# EAGLE design microstepper (EAGLE 7.6.0)

## Sheet 1 of 3
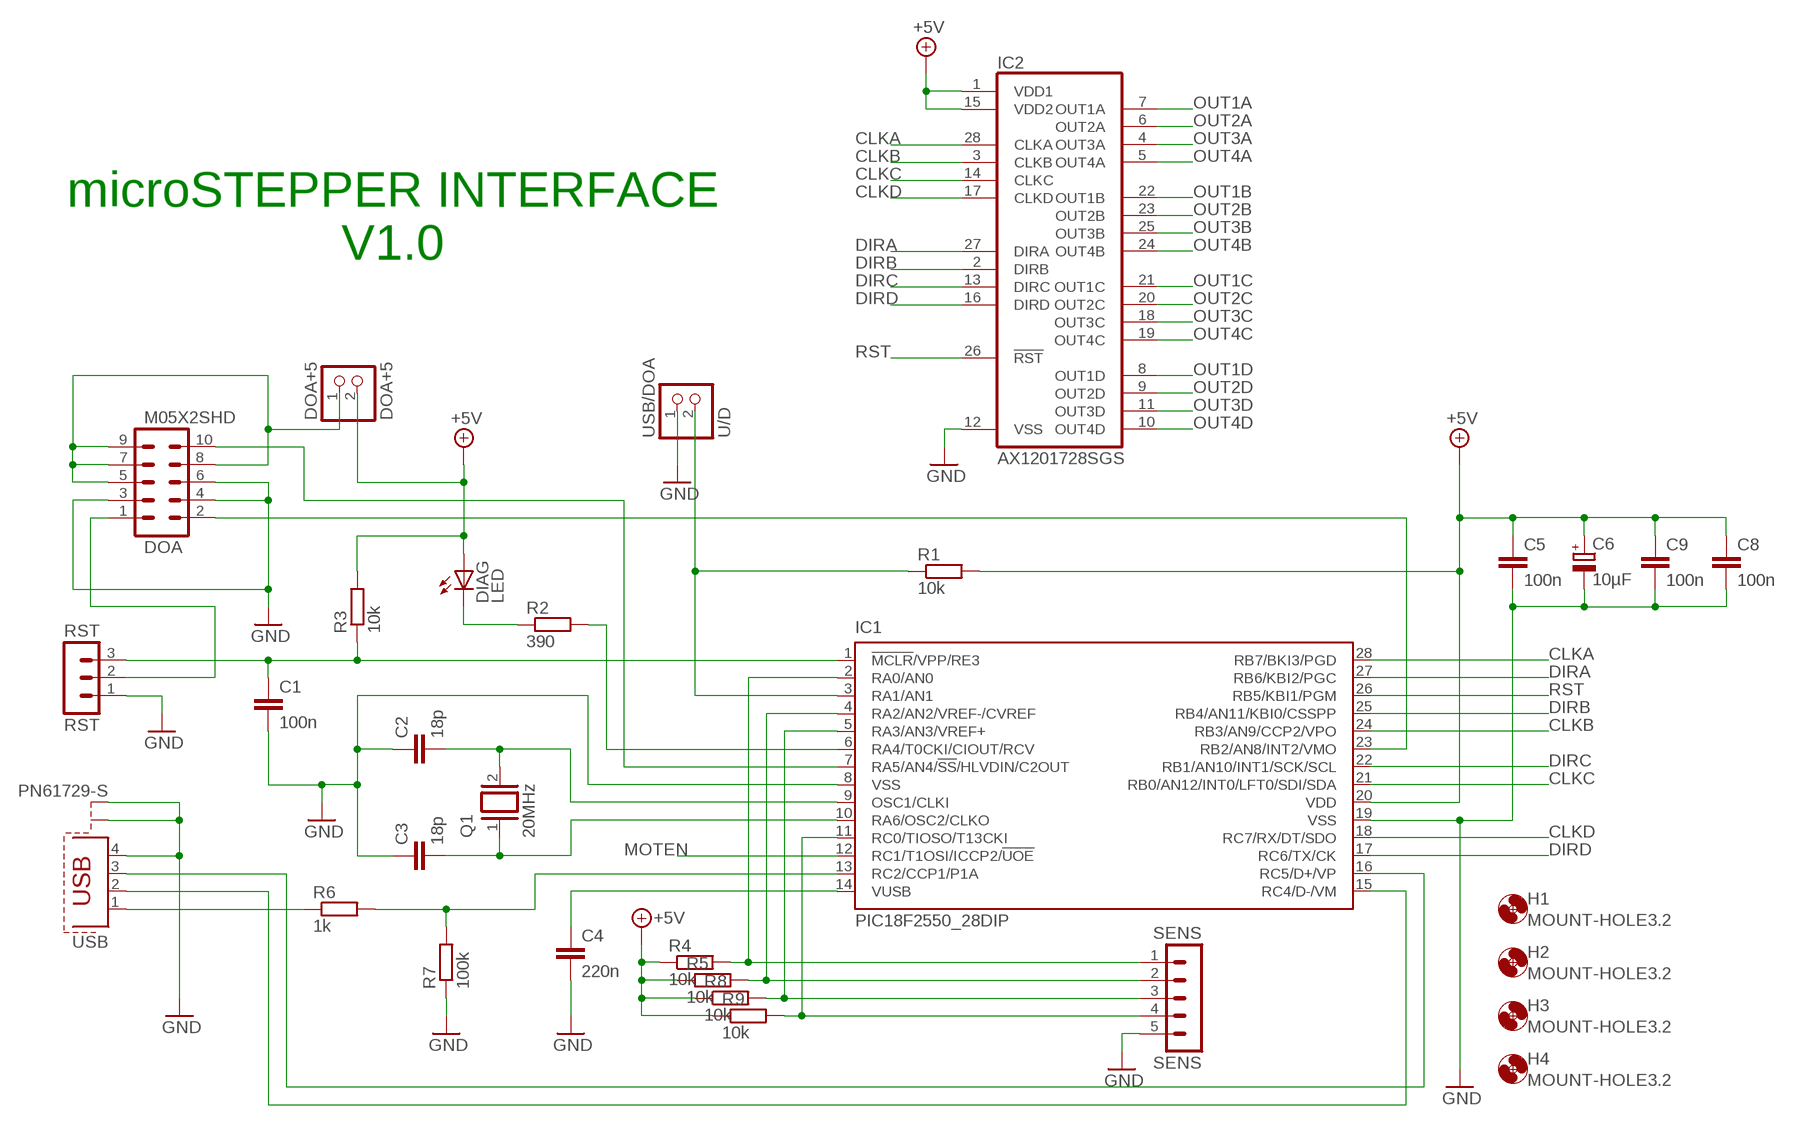
[diagram p0: schematic, sheet 1]

### Parts
C1  100n  C-EU025-025X050  [C025-025X050]
C2  18p  C-EU025-025X050  [C025-025X050]
C3  18p  C-EU025-025X050  [C025-025X050]
C4  220n  C5/3  [C5B3]
C5  100n  C-EU025-025X050  [C025-025X050]
C6  10µF  CPOL-EUE2.5-5  [E2,5-5]
C8  100n  C-EU025-025X050  [C025-025X050]
C9  100n  C-EU025-025X050  [C025-025X050]
DIAG  LED  LED3MM  [LED3MM]
DOA  M05X2SHD  [2X5-SHROUDED]
DOA+5  DOA+5  PINHD-1X2  [1X02]
H1  MOUNT-HOLE3.2  [3,2]
H2  MOUNT-HOLE3.2  [3,2]
H3  MOUNT-HOLE3.2  [3,2]
H4  MOUNT-HOLE3.2  [3,2]
IC1  PIC18F2550_28DIP  [DIL28-3]
IC2  AX1201728SGS  [SOP-28]
Q1  20MHz  XTAL/S  [QS]
R1  10k  R-EU_0204/7  [0204/7]
R2  390  R-EU_0204/7  [0204/7]
R3  10k  R-EU_0204/7  [0204/7]
R4  10k  R-EU_0204/7  [0204/7]
R5  10k  R-EU_0204/7  [0204/7]
R6  1k  R-EU_0204/7  [0204/7]
R7  100k  R-EU_0204/7  [0204/7]
R8  10k  R-EU_0204/7  [0204/7]
R9  10k  R-EU_0204/7  [0204/7]
RST  RST  MA03-1  [MA03-1]
SENS  SENS  MA05-1  [MA05-1]
USB  PN61729-S  [PN61729-S]
USB/DOA  U/D  PINHD-1X2  [1X02]

### Nets
+5V [+5V]: C5.1 C6.+ C8.1 C9.1 DIAG.A DOA+5.2 IC1.20(VDD) IC2.1(VDD1) IC2.15(VDD2) R1.2 R3.2 R4.1 R5.1 R8.1 R9.1 ; also sheet 2,3
CLKA: IC1.28(RB7/BKI3/PGD) IC2.28(CLKA)
CLKB: IC1.24(RB3/AN9/CCP2/VPO) IC2.3(CLKB)
CLKC: IC1.21(RB0/AN12/INT0/LFT0/SDI/SDA) IC2.14(CLKC)
CLKD: IC1.18(RC7/RX/DT/SDO) IC2.17(CLKD)
DIRA: IC1.27(RB6/KBI2/PGC) IC2.27(DIRA)
DIRB: IC1.25(RB4/AN11/KBI0/CSSPP) IC2.2(DIRB)
DIRC: IC1.22(RB1/AN10/INT1/SCK/SCL) IC2.13(DIRC)
DIRD: IC1.17(RC6/TX/CK) IC2.16(DIRD)
GND [ground]: C1.2 C2.1 C3.1 C4.2 C5.2 C6.- C8.2 C9.2 DOA.3 DOA.4 DOA.6 IC1.8(VSS) IC1.19(VSS) IC2.12(VSS) R7.1 RST.1 SENS.5 USB.4 USB.S1 USB.S2 USB/DOA.1 ; also sheet 2,3
MOTEN: IC1.12(RC1/T1OSI/ICCP2/!UOE) ; also sheet 2
N$9: IC1.11(RC0/TIOSO/T13CKI) R9.2 SENS.4
N$12: IC1.5(RA3/AN3/VREF+) R8.2 SENS.3
N$13: IC1.4(RA2/AN2/VREF-/CVREF) R5.2 SENS.2
N$22: IC1.2(RA0/AN0) R4.2 SENS.1
N$51: C4.1 IC1.14(VUSB)
N$54: IC1.16(RC5/D+/VP) USB.3
N$61: IC1.15(RC4/D-/VM) USB.2
N$62: R6.1 USB.1
N$63: IC1.13(RC2/CCP1/P1A) R6.2 R7.2
N$64: DOA.1 RST.2
N$65: C3.2 IC1.10(RA6/OSC2/CLKO) Q1.1
N$66: C2.2 IC1.9(OSC1/CLKI) Q1.2
N$67: C1.1 IC1.1(!MCLR!/VPP/RE3) R3.1 RST.3
N$71 [+5V]: DOA+5.1 DOA.5 DOA.7 DOA.8 DOA.9
N$72: DOA.2 IC1.23(RB2/AN8/INT2/VMO)
N$73: DIAG.K(C) R2.1
N$74: IC1.6(RA4/T0CKI/CIOUT/RCV) R2.2
N$75: DOA.10 IC1.7(RA5/AN4/!SS!/HLVDIN/C2OUT)
N$76: IC1.3(RA1/AN1) R1.1 USB/DOA.2
OUT1A: IC2.7(OUT1A) ; also sheet 2,3
OUT1B: IC2.22(OUT1B) ; also sheet 2,3
OUT1C: IC2.21(OUT1C) ; also sheet 2,3
OUT1D: IC2.8(OUT1D) ; also sheet 2,3
OUT2A: IC2.6(OUT2A) ; also sheet 2,3
OUT2B: IC2.23(OUT2B) ; also sheet 2,3
OUT2C: IC2.20(OUT2C) ; also sheet 2,3
OUT2D: IC2.9(OUT2D) ; also sheet 2,3
OUT3A: IC2.4(OUT3A) ; also sheet 2,3
OUT3B: IC2.25(OUT3B) ; also sheet 2,3
OUT3C: IC2.18(OUT3C) ; also sheet 2,3
OUT3D: IC2.11(OUT3D) ; also sheet 2,3
OUT4A: IC2.5(OUT4A) ; also sheet 2,3
OUT4B: IC2.24(OUT4B) ; also sheet 2,3
OUT4C: IC2.19(OUT4C) ; also sheet 2,3
OUT4D: IC2.10(OUT4D) ; also sheet 2,3
RST: IC1.26(RB5/KBI1/PGM) IC2.26(!RST)

### Notes on the sheet
- microSTEPPER INTERFACE
  V1.0

## Sheet 2 of 3
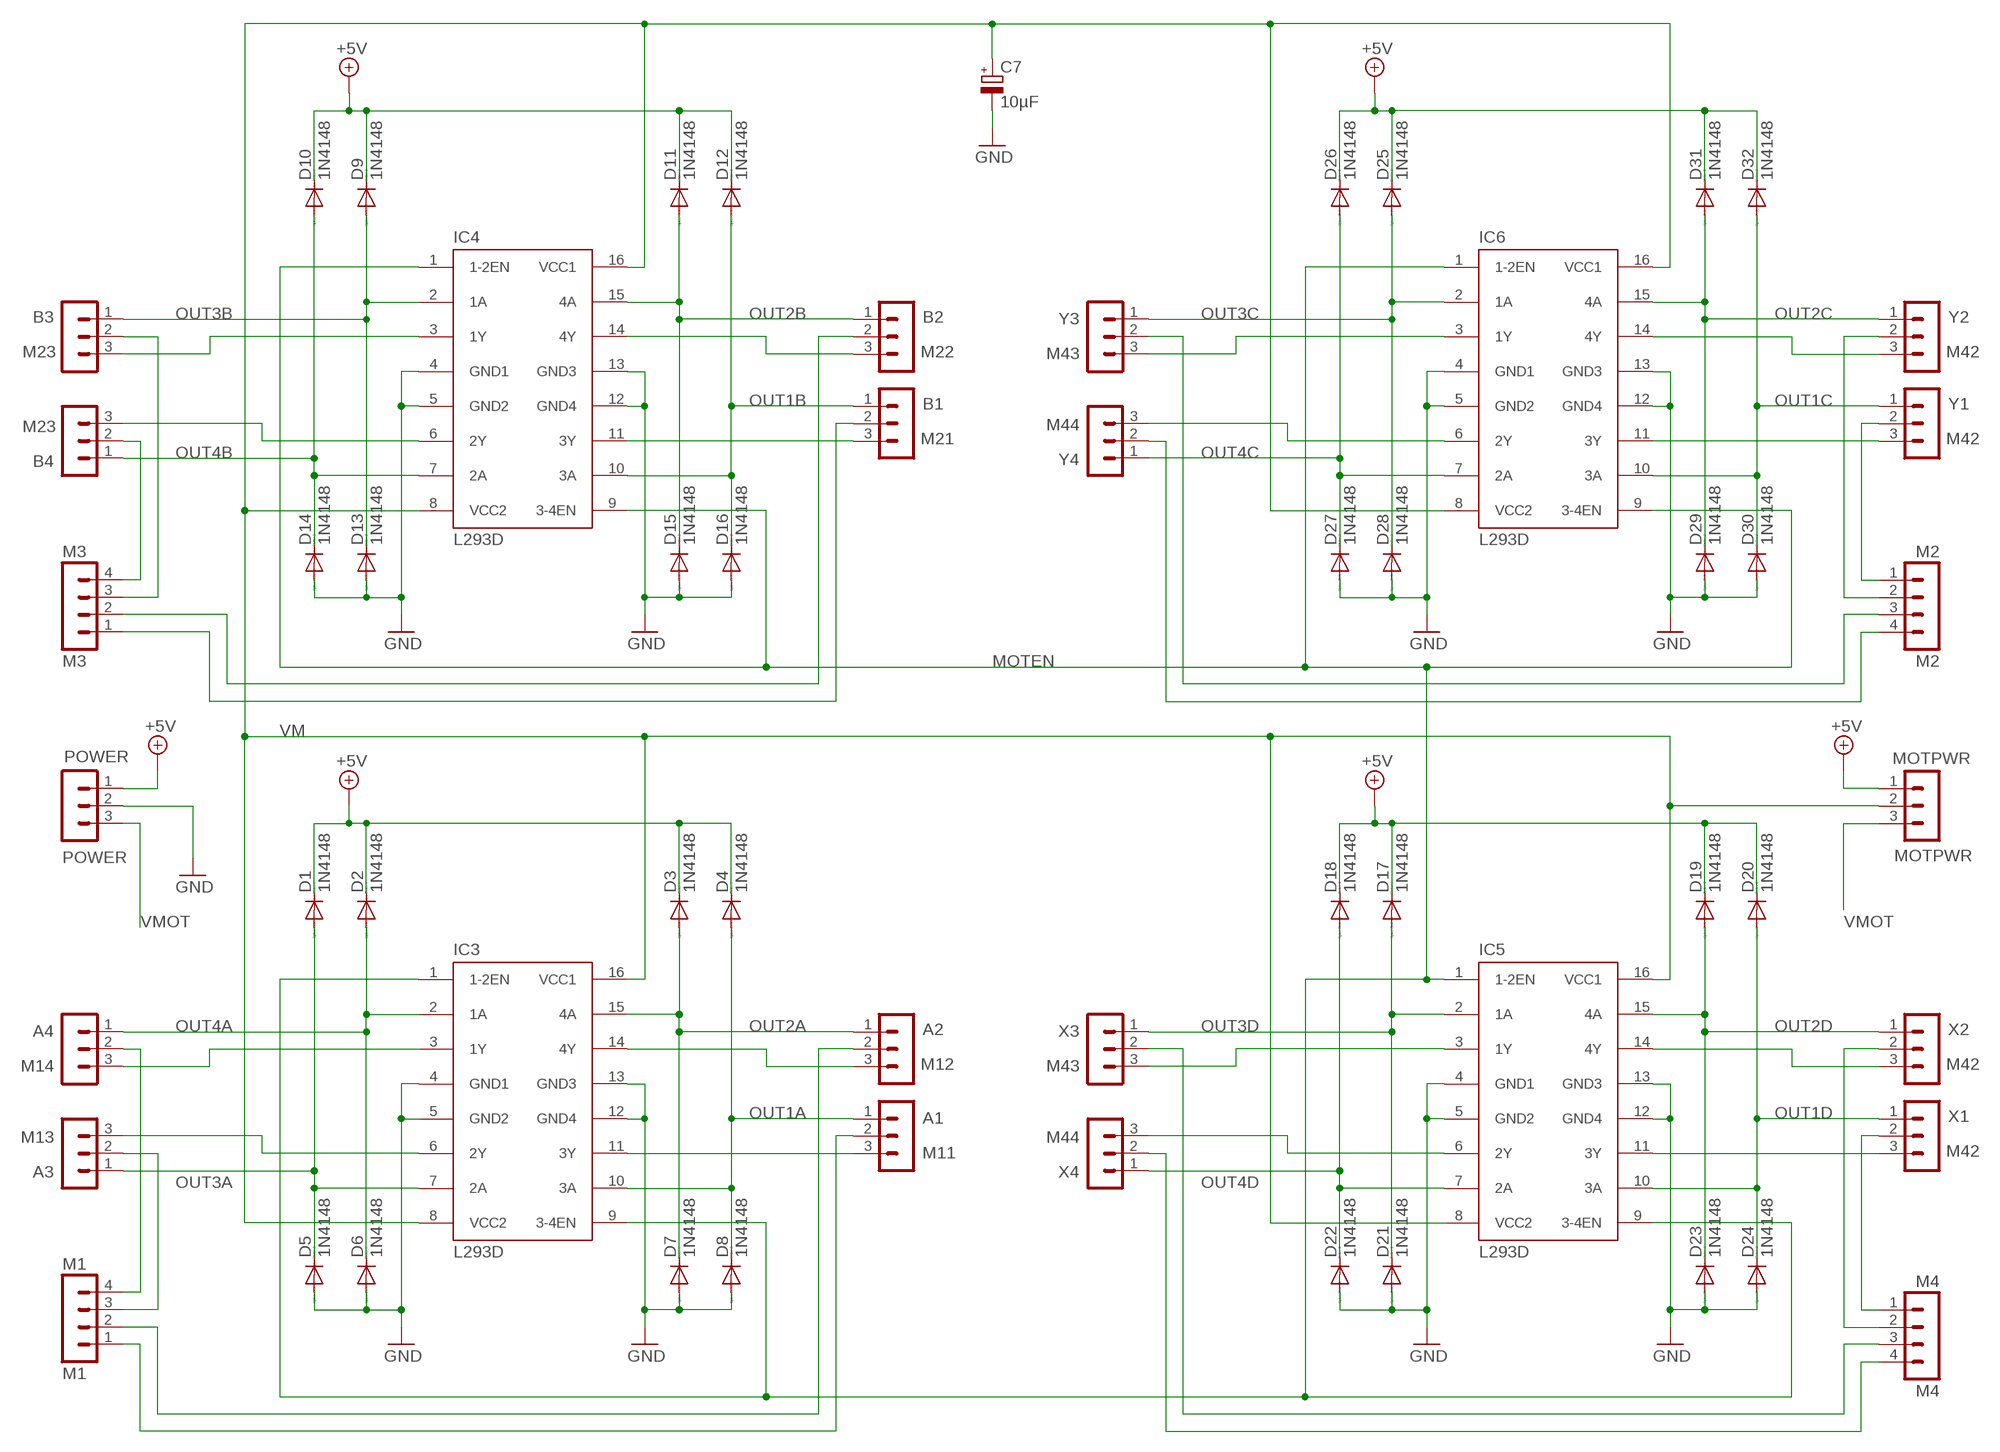
[diagram p1: schematic, sheet 2]

### Parts
A1  M11  MA03-1  [MA03-1]
A2  M12  MA03-1  [MA03-1]
A3  M13  MA03-1  [MA03-1]
A4  M14  MA03-1  [MA03-1]
B1  M21  MA03-1  [MA03-1]
B2  M22  MA03-1  [MA03-1]
B3  M23  MA03-1  [MA03-1]
B4  M23  MA03-1  [MA03-1]
C7  10µF  CPOL-EUE2.5-5  [E2,5-5]
D1  1N4148  1N4148DO35-7  [DO35-7]
D2  1N4148  1N4148DO35-7  [DO35-7]
D3  1N4148  1N4148DO35-7  [DO35-7]
D4  1N4148  1N4148DO35-7  [DO35-7]
D5  1N4148  1N4148DO35-7  [DO35-7]
D6  1N4148  1N4148DO35-7  [DO35-7]
D7  1N4148  1N4148DO35-7  [DO35-7]
D8  1N4148  1N4148DO35-7  [DO35-7]
D9  1N4148  1N4148DO35-7  [DO35-7]
D10  1N4148  1N4148DO35-7  [DO35-7]
D11  1N4148  1N4148DO35-7  [DO35-7]
D12  1N4148  1N4148DO35-7  [DO35-7]
D13  1N4148  1N4148DO35-7  [DO35-7]
D14  1N4148  1N4148DO35-7  [DO35-7]
D15  1N4148  1N4148DO35-7  [DO35-7]
D16  1N4148  1N4148DO35-7  [DO35-7]
D17  1N4148  1N4148DO35-7  [DO35-7]
D18  1N4148  1N4148DO35-7  [DO35-7]
D19  1N4148  1N4148DO35-7  [DO35-7]
D20  1N4148  1N4148DO35-7  [DO35-7]
D21  1N4148  1N4148DO35-7  [DO35-7]
D22  1N4148  1N4148DO35-7  [DO35-7]
D23  1N4148  1N4148DO35-7  [DO35-7]
D24  1N4148  1N4148DO35-7  [DO35-7]
D25  1N4148  1N4148DO35-7  [DO35-7]
D26  1N4148  1N4148DO35-7  [DO35-7]
D27  1N4148  1N4148DO35-7  [DO35-7]
D28  1N4148  1N4148DO35-7  [DO35-7]
D29  1N4148  1N4148DO35-7  [DO35-7]
D30  1N4148  1N4148DO35-7  [DO35-7]
D31  1N4148  1N4148DO35-7  [DO35-7]
D32  1N4148  1N4148DO35-7  [DO35-7]
IC3  L293D  [DIL16]
IC4  L293D  [DIL16]
IC5  L293D  [DIL16]
IC6  L293D  [DIL16]
M1  M1  MA04-1  [MA04-1]
M2  M2  MA04-1  [MA04-1]
M3  M3  MA04-1  [MA04-1]
M4  M4  MA04-1  [MA04-1]
MOTPWR  MOTPWR  MA03-1  [MA03-1]
POWER  POWER  MA03-1  [MA03-1]
X1  M42  MA03-1  [MA03-1]
X2  M42  MA03-1  [MA03-1]
X3  M43  MA03-1  [MA03-1]
X4  M44  MA03-1  [MA03-1]
Y1  M42  MA03-1  [MA03-1]
Y2  M42  MA03-1  [MA03-1]
Y3  M43  MA03-1  [MA03-1]
Y4  M44  MA03-1  [MA03-1]

### Nets
+5V [+5V]: D1.C D2.C D3.C D4.C D9.C D10.C D11.C D12.C D17.C D18.C D19.C D20.C D25.C D26.C D31.C D32.C MOTPWR.1 POWER.1 ; also sheet 1,3
GND [ground]: C7.- D5.A D6.A D7.A D8.A D13.A D14.A D15.A D16.A D21.A D22.A D23.A D24.A D27.A D28.A D29.A D30.A IC3.4(GND1) IC3.5(GND2) IC3.12(GND4) IC3.13(GND3) IC4.4(GND1) IC4.5(GND2) IC4.12(GND4) IC4.13(GND3) IC5.4(GND1) IC5.5(GND2) IC5.12(GND4) IC5.13(GND3) IC6.4(GND1) IC6.5(GND2) IC6.12(GND4) IC6.13(GND3) POWER.2 ; also sheet 1,3
MOTEN: IC3.1(1-2EN) IC3.9(3-4EN) IC4.1(1-2EN) IC4.9(3-4EN) IC5.1(1-2EN) IC5.9(3-4EN) IC6.1(1-2EN) IC6.9(3-4EN) ; also sheet 1
N$1: A1.3 IC3.11(3Y)
N$2: A2.3 IC3.14(4Y)
N$3: A3.3 IC3.6(2Y)
N$4: A4.3 IC3.3(1Y)
N$5: B2.3 IC4.14(4Y)
N$6: B1.3 IC4.11(3Y)
N$7: B4.3 IC4.6(2Y)
N$8: B3.3 IC4.3(1Y)
N$10: IC5.14(4Y) X2.3
N$11: IC5.11(3Y) X1.3
N$14: IC6.14(4Y) Y2.3
N$15: IC5.6(2Y) X4.3
N$16: IC6.11(3Y) Y1.3
N$17: IC5.3(1Y) X3.3
N$18: IC6.3(1Y) Y3.3
N$19: IC6.6(2Y) Y4.3
N$20: B1.2 M3.1
N$21: B2.2 M3.2
N$24: B4.2 M3.4
N$25: B3.2 M3.3
N$35: A4.2 M1.4
N$40: A3.2 M1.3
N$41: A1.2 M1.1
N$42: A2.2 M1.2
N$43: M4.1 X1.2
N$44: M4.2 X2.2
N$45: M4.4 X4.2
N$46: M4.3 X3.2
N$47: M2.1 Y1.2
N$48: M2.2 Y2.2
N$49: M2.4 Y4.2
N$50: M2.3 Y3.2
OUT1A: A1.1 D4.A D8.C IC3.10(3A) ; also sheet 1,3
OUT1B: B1.1 D12.A D16.C IC4.10(3A) ; also sheet 1,3
OUT1C: D30.C D32.A IC6.10(3A) Y1.1 ; also sheet 1,3
OUT1D: D20.A D24.C IC5.10(3A) X1.1 ; also sheet 1,3
OUT2A: A2.1 D3.A D7.C IC3.15(4A) ; also sheet 1,3
OUT2B: B2.1 D11.A D15.C IC4.15(4A) ; also sheet 1,3
OUT2C: D29.C D31.A IC6.15(4A) Y2.1 ; also sheet 1,3
OUT2D: D19.A D23.C IC5.15(4A) X2.1 ; also sheet 1,3
OUT3A: A3.1 D1.A D5.C IC3.7(2A) ; also sheet 1,3
OUT3B: B3.1 D9.A D13.C IC4.2(1A) ; also sheet 1,3
OUT3C: D25.A D28.C IC6.2(1A) Y3.1 ; also sheet 1,3
OUT3D: D17.A D21.C IC5.2(1A) X3.1 ; also sheet 1,3
OUT4A: A4.1 D2.A D6.C IC3.2(1A) ; also sheet 1,3
OUT4B: B4.1 D10.A D14.C IC4.7(2A) ; also sheet 1,3
OUT4C: D26.A D27.C IC6.7(2A) Y4.1 ; also sheet 1,3
OUT4D: D18.A D22.C IC5.7(2A) X4.1 ; also sheet 1,3
VM [VM]: C7.+ IC3.8(VCC2) IC3.16(VCC1) IC4.8(VCC2) IC4.16(VCC1) IC5.8(VCC2) IC5.16(VCC1) IC6.8(VCC2) IC6.16(VCC1) MOTPWR.2
VMOT [VMOT]: MOTPWR.3 POWER.3

## Sheet 3 of 3
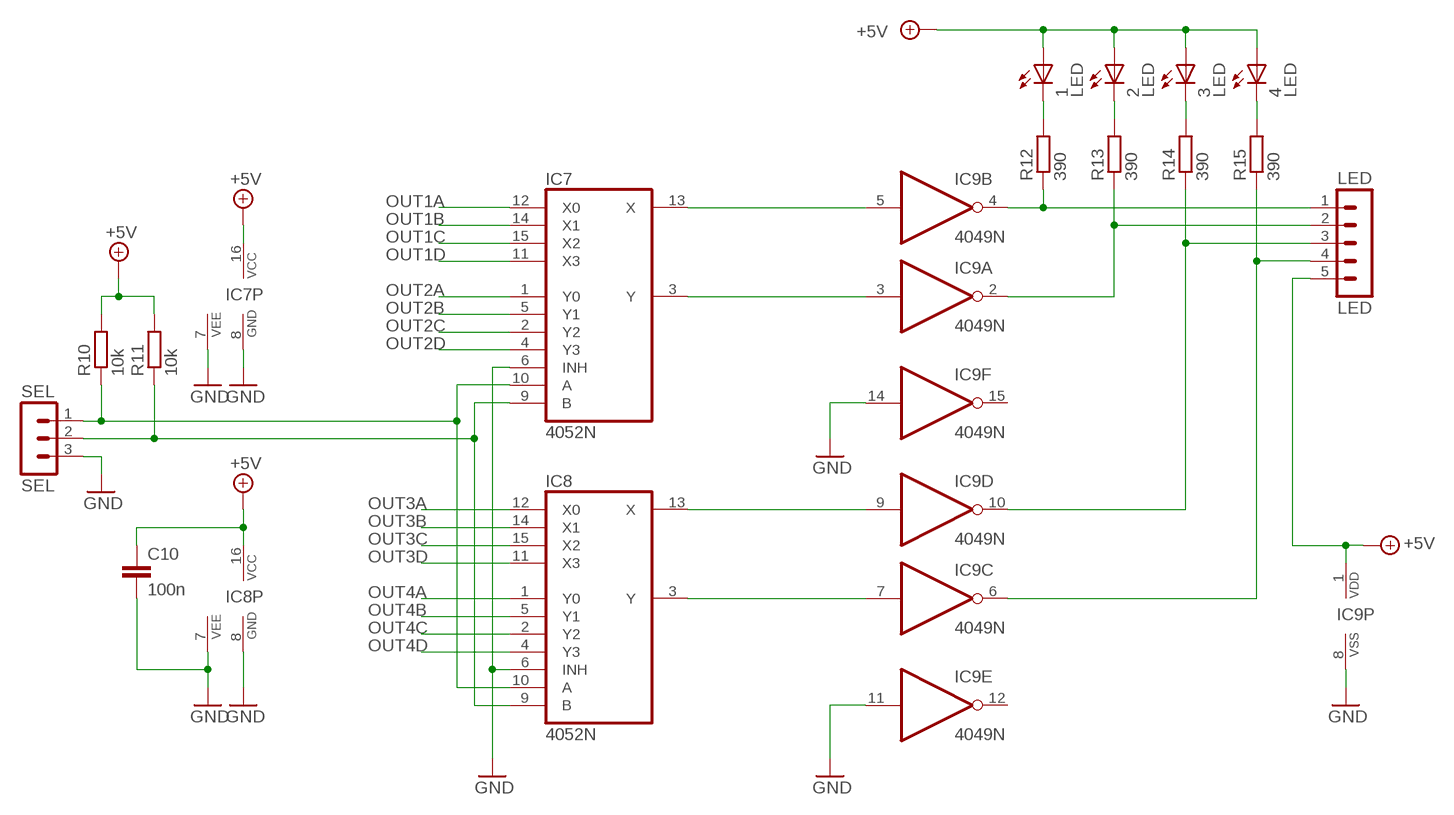
[diagram p2: schematic, sheet 3]

### Parts
1  LED  LED3MM  [LED3MM]
2  LED  LED3MM  [LED3MM]
3  LED  LED3MM  [LED3MM]
4  LED  LED3MM  [LED3MM]
C10  100n  C-EU025-025X050  [C025-025X050]
IC7  4052N  [DIL16]
IC8  4052N  [DIL16]
IC9  4049N  [DIL16]
LED  LED  MA05-1  [MA05-1]
R10  10k  R-EU_0204/7  [0204/7]
R11  10k  R-EU_0204/7  [0204/7]
R12  390  R-EU_0204/7  [0204/7]
R13  390  R-EU_0204/7  [0204/7]
R14  390  R-EU_0204/7  [0204/7]
R15  390  R-EU_0204/7  [0204/7]
SEL  SEL  MA03-1  [MA03-1]

### Nets
+5V [+5V]: 1.A 2.A 3.A 4.A C10.1 IC7.16(VCC) IC8.16(VCC) IC9.1(P:VDD) LED.5 R10.2 R11.2 ; also sheet 1,2
GND [ground]: C10.2 IC7.6(INH) IC7.7(VEE) IC7.8(GND) IC8.6(INH) IC8.7(VEE) IC8.8(GND) IC9.8(P:VSS) IC9.11(E:I) IC9.14(F:I) SEL.3 ; also sheet 1,2
N$23: IC7.9(B) IC8.9(B) R11.1 SEL.2
N$26: IC7.10(A) IC8.10(A) R10.1 SEL.1
N$27: IC7.3(Y) IC9.3(A:I)
N$28: IC7.13(X) IC9.5(B:I)
N$29: IC8.3(Y) IC9.7(C:I)
N$30: IC8.13(X) IC9.9(D:I)
N$31: IC9.4(B:O) LED.1 R12.1
N$32: IC9.2(A:O) LED.2 R13.1
N$33: IC9.10(D:O) LED.3 R14.1
N$34: IC9.6(C:O) LED.4 R15.1
N$36: 1.K(C) R12.2
N$37: 2.K(C) R13.2
N$38: 3.K(C) R14.2
N$39: 4.K(C) R15.2
OUT1A: IC7.12(X0) ; also sheet 1,2
OUT1B: IC7.14(X1) ; also sheet 1,2
OUT1C: IC7.15(X2) ; also sheet 1,2
OUT1D: IC7.11(X3) ; also sheet 1,2
OUT2A: IC7.1(Y0) ; also sheet 1,2
OUT2B: IC7.5(Y1) ; also sheet 1,2
OUT2C: IC7.2(Y2) ; also sheet 1,2
OUT2D: IC7.4(Y3) ; also sheet 1,2
OUT3A: IC8.12(X0) ; also sheet 1,2
OUT3B: IC8.14(X1) ; also sheet 1,2
OUT3C: IC8.15(X2) ; also sheet 1,2
OUT3D: IC8.11(X3) ; also sheet 1,2
OUT4A: IC8.1(Y0) ; also sheet 1,2
OUT4B: IC8.5(Y1) ; also sheet 1,2
OUT4C: IC8.2(Y2) ; also sheet 1,2
OUT4D: IC8.4(Y3) ; also sheet 1,2
Unconnected: IC9.12(E:O) IC9.15(F:O)

## Library data of the parts
1-4 DIAG = henk:LED: LEDs Standard schematic elements and footprints for 5mm, 3mm, 1206, and 0603 sized LEDs. 5mm - Spark Fun Electronics SKU : COM-00529 (and others)
A1-A4 B1-B4 MOTPWR POWER RST SEL X1-X4 Y1-Y4 = con-lstb:MA03-1: PIN HEADER; OC_FARNELL: unknown; OC_NEWARK: unknown
C1-C3 C5 C8-C10 = rcl:C-EU: CAPACITOR, European symbol
C4 = capacitor-wima:C: CAPACITOR naming: grid - package width
C6 C7 = rcl:CPOL-EU: POLARIZED CAPACITOR, European symbol
D1-D32 = diode:1N4148: DIODE high speed (Philips)
DOA = henk:M05X2: Header 5x2 Standard 10-pin dual row 0.1" header. Commonly used with AVR-ISP. Use with Spark Fun Electronics SKU: PRT-00778
DOA+5 USB/DOA = pinhead:PINHD-1X2: PIN HEADER
H1-H4 = holes:MOUNT-HOLE: MOUNTING HOLE with drill center marker
IC1 = microchip:PIC18F2*_28: USB Microcontrollers with nanoWatt Technology High-Performance, Enhanced Flash, 28/40/44-Pin, Source: http://ww1.microchip.com/downloads/en/devicedoc/39632c.pdf; MF: MICROCHIP; MPN: PIC18F2550-I/SP; OC_FARNELL: 1523822; OC_NEWARK: 80K6054
IC2 = memory-bsi:AX1201728SG
IC3-IC6 = st-microelectronics:L293D: PUSH-PULL 4 CHANNEL DRIVER; MPN: L293D; OC_FARNELL: 9589619; OC_NEWARK: 56P8249
IC7 IC8 = 40xx:4052: Dual 4-channel ANALOG MULTIPLEXER
IC9 = 40xx:4049: Hex inverting BUFFER
LED SENS = con-lstb:MA05-1: PIN HEADER; OC_FARNELL: unknown; OC_NEWARK: unknown
M1-M4 = con-lstb:MA04-1: PIN HEADER; OC_FARNELL: unknown; OC_NEWARK: unknown
Q1 = special:XTAL/S: CRYSTAL
R1-R15 = rcl:R-EU_: RESISTOR, European symbol
USB = con-berg:PN61729-S: BERG USB connector; OC_FARNELL: unknown; OC_NEWARK: unknown

## Net classes
0 default: width 0.254 mm, clearance 0.381 mm
1 ground: width 0.508 mm, clearance 0.381 mm
2 +5V: width 0.508 mm, clearance 0.381 mm
3 VMOT: width 0.508 mm, clearance 0.381 mm
4 VM: width 0.508 mm, clearance 0.381 mm

## Board
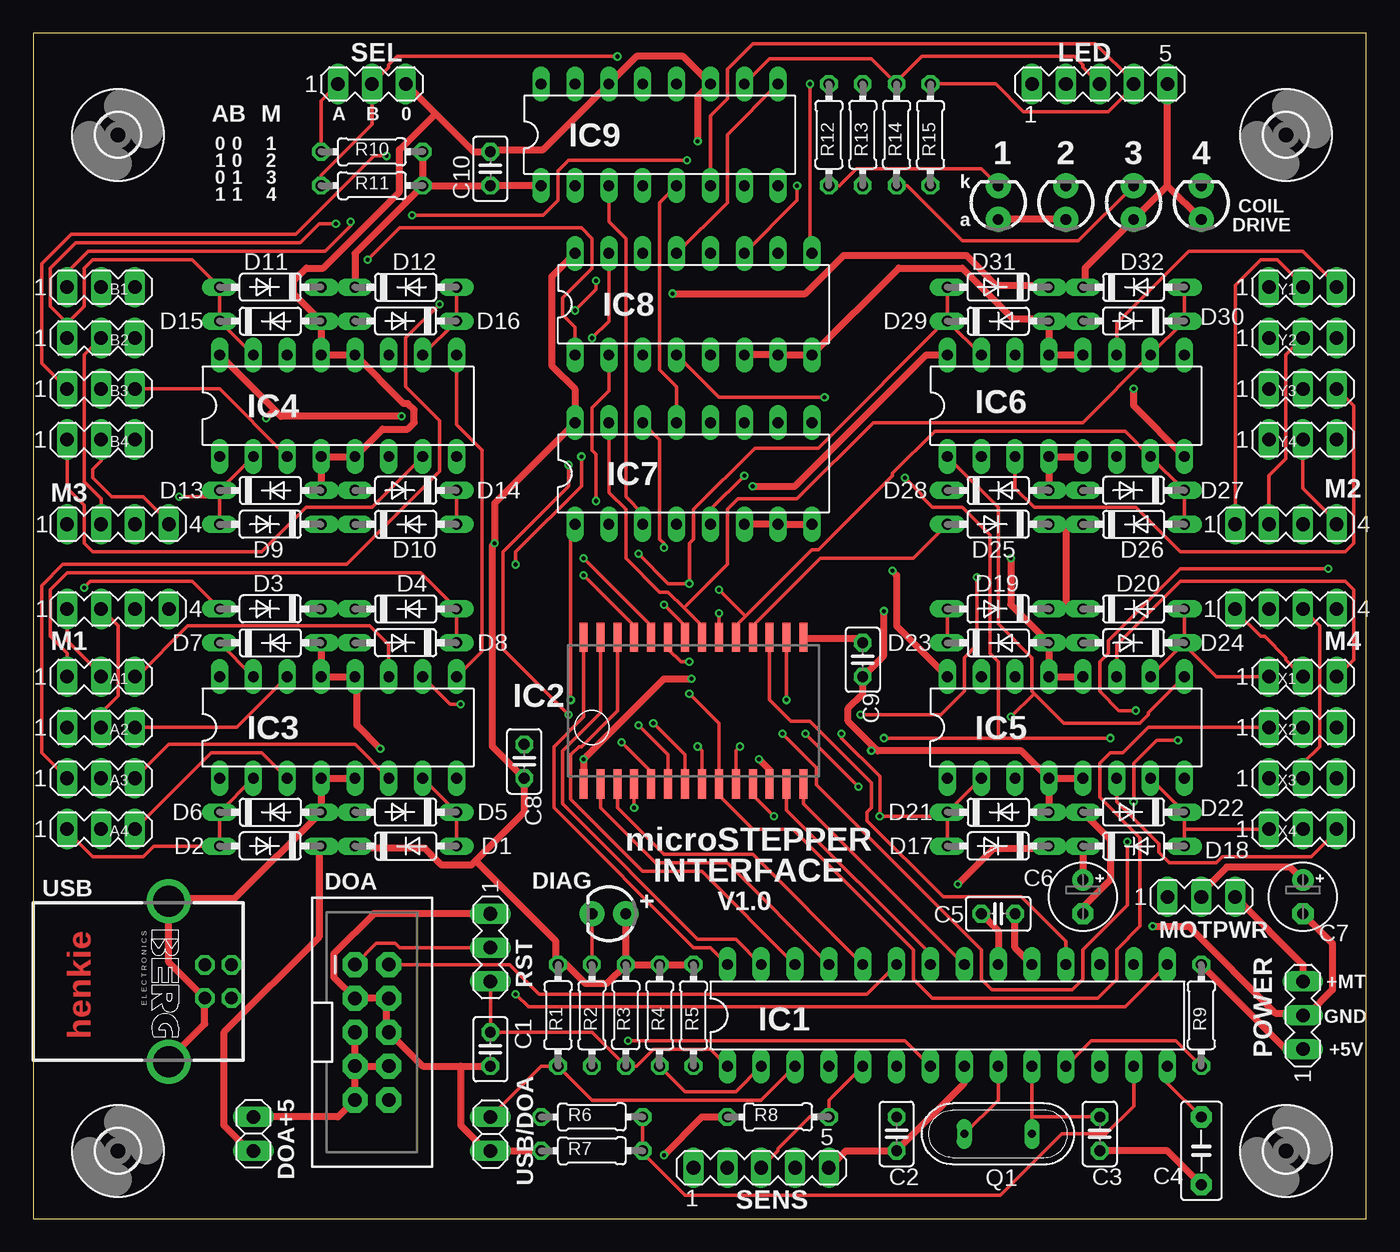
[diagram p3: board, top side]
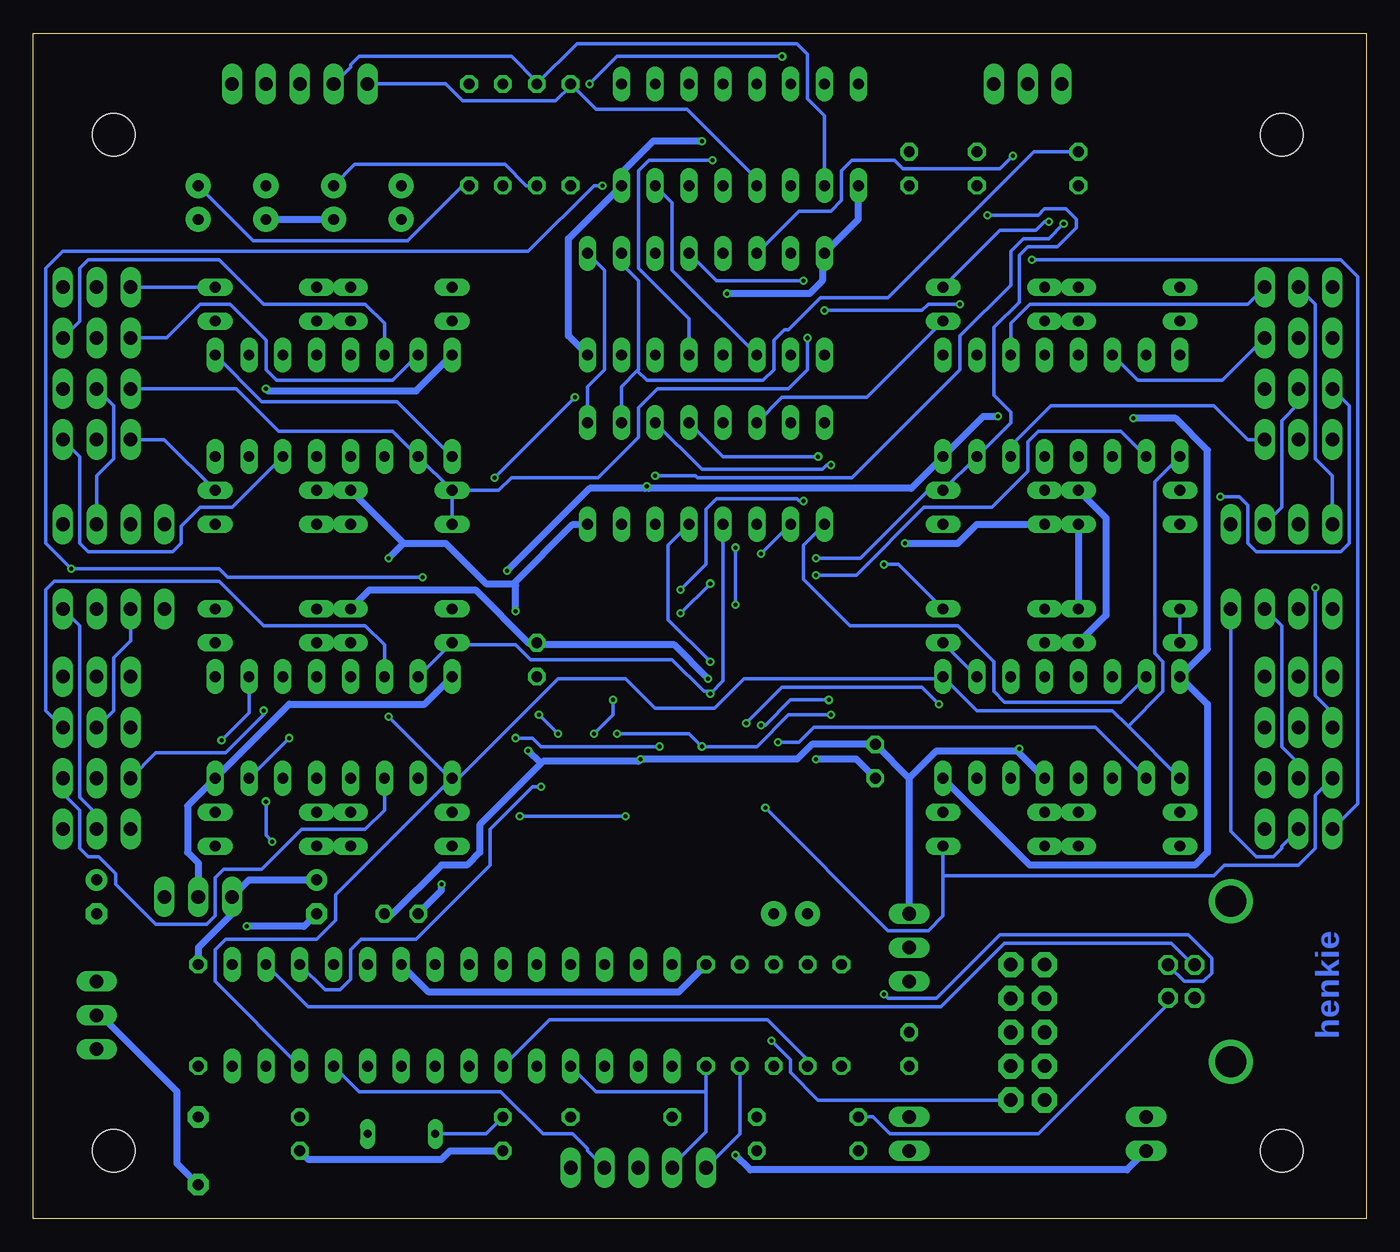
[diagram p4: board, bottom side, seen from below]

Size 100 x 88.89 mm. Coordinates in mm from the lower left corner, seen from the top.
Outline: 0,0 100,0 100,88.89 0,88.89 0,0
Copper layers (1*16): Top 0.035mm / dielectric 1.5mm / Bottom 0.035mm
Design rules "ITEADstudio_DRC": minimum track width 6mil, minimum drill 12mil, track to track 6mil, track to pad 6mil, pad to pad 6mil, via to via 6mil, smd to smd 0mil, copper to edge 10mil, drill to drill 10mil, minimum pad ring 10mil, minimum via ring 6mil, stop-mask expansion 2mil, vias tented up to drill 100mil, thermal gap 10mil

### Footprints (pad centres in the part's own frame; a part is rotated, then mirrored left to right if it is on the bottom)
LED3MM = drill 0.813 pad 1.88: A -1.27,0; K 1.27,0
MA03-1 = drill 1.016 long: 1 -2.54,0; 2 0,0; 3 2.54,0
C025-025X050 = drill 0.813 octagon: 1 -1.27,0; 2 1.27,0
C5B3 = drill 0.813 pad 1.6 octagon: 1 -2.54,0; 2 2.54,0
E2,5-5 = drill 0.813 pad 1.6: + -1.27,0 | drill 0.813 pad 1.6 octagon: - 1.27,0
DO35-7 = drill 0.813 long: A 3.81,0; C -3.81,0
2X5-SHROUDED = drill 1.016 pad 1.88 octagon: 1 -1.27,5.08; 2 1.27,5.08; 3 -1.27,2.54; 4 1.27,2.54; 5 -1.27,0; 6 1.27,0; 7 -1.27,-2.54; 8 1.27,-2.54; 9 -1.27,-5.08; 10 1.27,-5.08
1X02 = drill 1.016 long: 1 -1.27,0; 2 1.27,0
3,2 = hole 3.2: 0,0
DIL28-3 = drill 0.813 long: 1 -16.51,-3.81; 2 -13.97,-3.81; 3 -11.43,-3.81; 4 -8.89,-3.81; 5 -6.35,-3.81; 6 -3.81,-3.81; 7 -1.27,-3.81; 8 1.27,-3.81; 9 3.81,-3.81; 10 6.35,-3.81; 11 8.89,-3.81; 12 11.43,-3.81; 13 13.97,-3.81; 14 16.51,-3.81; 15 16.51,3.81; 16 13.97,3.81; 17 11.43,3.81; 18 8.89,3.81; 19 6.35,3.81; 20 3.81,3.81; 21 1.27,3.81; 22 -1.27,3.81; 23 -3.81,3.81; 24 -6.35,3.81; 25 -8.89,3.81; 26 -11.43,3.81; 27 -13.97,3.81; 28 -16.51,3.81
SOP-28 = smd 0.6 x 2.2: 1 1.905,-10.58; 2 3.175,-10.58; 3 4.445,-10.58; 4 5.715,-10.58; 5 6.985,-10.58; 6 8.255,-10.58; 7 9.525,-10.58; 8 10.795,-10.58; 9 12.065,-10.58; 10 13.335,-10.58; 11 14.605,-10.58; 12 15.875,-10.58; 13 17.145,-10.58; 14 18.415,-10.58; 15 18.415,0.42; 16 17.145,0.42; 17 15.875,0.42; 18 14.605,0.42; 19 13.335,0.42; 20 12.065,0.42; 21 10.795,0.42; 22 9.525,0.42; 23 8.255,0.42; 24 6.985,0.42; 25 5.715,0.42; 26 4.445,0.42; 27 3.175,0.42; 28 1.905,0.42
DIL16 = drill 0.813 long: 1 -8.89,-3.81; 2 -6.35,-3.81; 3 -3.81,-3.81; 4 -1.27,-3.81; 5 1.27,-3.81; 6 3.81,-3.81; 7 6.35,-3.81; 8 8.89,-3.81; 9 8.89,3.81; 10 6.35,3.81; 11 3.81,3.81; 12 1.27,3.81; 13 -1.27,3.81; 14 -3.81,3.81; 15 -6.35,3.81; 16 -8.89,3.81
MA05-1 = drill 1.016 long: 1 -5.08,0; 2 -2.54,0; 3 0,0; 4 2.54,0; 5 5.08,0
MA04-1 = drill 1.016 long: 1 -3.81,0; 2 -1.27,0; 3 1.27,0; 4 3.81,0
QS = drill 0.61 long: 1 -2.54,0; 2 2.54,0
0204/7 = drill 0.813 octagon: 1 -3.81,0; 2 3.81,0
PN61729-S = drill 0.95 octagon: 1 1.25,4.71; 2 -1.25,4.71; 3 -1.25,2.71; 4 1.25,2.71 | drill 2.3 pad 2.9: S1 -6.02,0; S2 6.02,0

### Placement (x,y rotation side)
1  72.39,76.2 90 top
2  77.47,76.2 90 top
3  82.55,76.2 90 top
4  87.63,76.2 90 top
A1  5.08,40.64 0 top
A2  5.08,36.83 0 top
A3  5.08,33.02 0 top
A4  5.08,29.21 0 top
B1  5.08,69.85 0 top
B2  5.08,66.04 0 top
B3  5.08,62.23 0 top
B4  5.08,58.42 0 top
C1  34.29,12.7 270 top
C2  64.77,6.35 90 top
C3  80.01,6.35 90 top
C4  87.63,5.08 270 top
C5  72.39,22.86 0 top
C6  78.74,24.13 270 top
C7  95.25,24.13 270 top
C8  36.83,34.29 90 top
C9  62.23,41.91 270 top
C10  34.29,78.74 90 top
D1  27.94,27.94 0 top
D2  17.78,27.94 180 top
D3  17.78,45.72 180 top
D4  27.94,45.72 0 top
D5  27.94,30.48 180 top
D6  17.78,30.48 0 top
D7  17.78,43.18 0 top
D8  27.94,43.18 180 top
D9  17.78,52.07 180 top
D10  27.94,52.07 0 top
D11  17.78,69.85 180 top
D12  27.94,69.85 0 top
D13  17.78,54.61 0 top
D14  27.94,54.61 180 top
D15  17.78,67.31 0 top
D16  27.94,67.31 180 top
D17  72.39,27.94 180 top
D18  82.55,27.94 0 top
D19  72.39,45.72 180 top
D20  82.55,45.72 0 top
D21  72.39,30.48 0 top
D22  82.55,30.48 180 top
D23  72.39,43.18 0 top
D24  82.55,43.18 180 top
D25  72.39,52.07 180 top
D26  82.55,52.07 0 top
D27  82.55,54.61 180 top
D28  72.39,54.61 0 top
D29  72.39,67.31 0 top
D30  82.55,67.31 180 top
D31  72.39,69.85 180 top
D32  82.55,69.85 0 top
DIAG  43.18,22.86 180 top
DOA  25.4,13.97 0 top
DOA+5  16.51,6.35 270 top
H1  6.35,81.28 0 top
H2  93.98,5.08 0 top
H3  6.35,5.08 0 top
H4  93.98,81.28 0 top
IC1  68.58,15.24 0 top
IC2  39.37,43.18 0 top
IC3  22.86,36.83 0 top
IC4  22.86,60.96 0 top
IC5  77.47,36.83 0 top
IC6  77.47,60.96 0 top
IC7  49.53,55.88 0 top
IC8  49.53,68.58 0 top
IC9  46.99,81.28 0 top
LED  80.01,85.09 0 top
M1  6.35,45.72 0 top
M2  93.98,52.07 0 top
M3  6.35,52.07 0 top
M4  93.98,45.72 0 top
MOTPWR  87.63,24.13 0 top
POWER  95.25,15.24 90 top
Q1  72.39,6.35 180 top
R1  39.37,15.24 90 top
R2  41.91,15.24 270 top
R3  44.45,15.24 90 top
R4  46.99,15.24 270 top
R5  49.53,15.24 270 top
R6  41.91,7.62 0 top
R7  41.91,5.08 0 top
R8  55.88,7.62 0 top
R9  87.63,15.24 270 top
R10  25.4,80.01 0 top
R11  25.4,77.47 0 top
R12  59.69,81.28 270 top
R13  62.23,81.28 270 top
R14  64.77,81.28 270 top
R15  67.31,81.28 270 top
RST  34.29,20.32 270 top
SEL  25.4,85.09 0 top
SENS  54.61,3.81 0 top
USB  10.16,17.78 270 top
USB/DOA  34.29,6.35 90 top
X1  95.25,40.64 0 top
X2  95.25,36.83 0 top
X3  95.25,33.02 0 top
X4  95.25,29.21 0 top
Y1  95.25,69.85 0 top
Y2  95.25,66.04 0 top
Y3  95.25,62.23 0 top
Y4  95.25,58.42 0 top

### Tracks (layer width: path | path; a pad name or v marks a point on that pad's centre or on a via)
+5V  (via drill 0.3)
  Top 0.508: 2.A 1.A | 85.09,77.47 LED.5 | 85.09,77.47 3.A 78.9,71.28 78.9,70.01 D32.C D31.C 76.04,70.01 72.23,70.01 70.01,72.23 60.8,72.23 57.94,69.37 v47.94,69.37 | 85.09,77.47 4.A | IC9.1 C10.1 R11.2 | D11.C D12.C 24.13,72.39 R11.2 | R10.2 R11.2 | D4.C D3.C | D10.C D9.C | IC8.16 38.89,70.64 38.89,63.98 40.64,62.23 IC7.16 34.61,53.66 v34.61,50.64 34.45,50.48 34.45,35.4 C8.1 36.83,30.48 33.18,26.83 | R8.1 50.16,7.62 v47.31,4.76 | C6.+ D18.C D17.C 76.04,27.78 72.07,27.78 v69.37,25.08 | POWER.1 93.98,12.7 R9.1 | C9.1 61.91,43.5 57.78,43.5 IC2.15 | D20.C D19.C 77.47,45.88 77.47,51.91 D25.C D26.C | IC2.1 v41.27,34.45 47.31,40.48 v49.37,40.48 | 33.18,26.83 32.86,26.51 30.64,26.51 29.37,27.78 24.29,27.78 D1.C D2.C 21.43,27.78 21.43,21.11 14.29,13.97 14.29,6.99 16.19,5.08 DOA+5.2 | IC1.20 72.39,21.59 C5.1 | R3.2 43.02,17.62 41.43,17.62 40.01,19.05 R1.2 39.21,19.21 39.21,20.8 33.18,26.83 | R3.2 R4.1 R5.1 | R3.2 DIAG.A
  Bottom 0.508: 3.A 2.A | D9.C D3.C | D10.C 29.21,52.07 30.64,50.64 v34.61,50.64 | IC9.1 38.1,74.93 IC8.16 40.8,72.23 40.8,70.33 41.75,69.37 v47.94,69.37 | v47.31,4.76 46.2,3.65 17.94,3.65 DOA+5.2 | R9.1 87.63,20.32 85.09,22.86 MOTPWR.1 83.82,25.4 C6.+ | D19.C 74.77,47.15 66.83,47.15 62.87,43.18 C9.1 62.07,43.02 51.91,43.02 v49.37,40.48 | v41.27,34.45 38.26,34.45 C8.1 | IC1.20 70.33,16.99 51.59,16.99 R5.1 | v69.37,25.08 69.37,24.61 C5.1
CLKA
  Top 0.254: IC2.28 41.27,37.62 39.05,35.4 39.05,30.8 49.53,20.32 50.8,20.32 IC1.28
CLKB
  Top 0.254: IC2.3 43.81,30.8 47.31,27.3 53.98,27.3 IC1.24
CLKC
  Top 0.254: IC2.14 57.78,31.11 IC1.21
CLKD
  Top 0.254: IC2.17 55.24,38.89 56.83,37.31 58.26,37.31 62.87,32.7 62.87,30.8 62.55,30.48 62.55,29.84 68.26,24.13 74.14,24.13 77.47,20.8 IC1.18
DIRA
  Top 0.254: IC2.27 42.55,37.94 39.69,35.08 39.69,31.11 49.85,20.95 52.7,20.95 IC1.27
DIRB
  Top 0.254: IC2.2 42.55,30.8 46.67,26.67 52.07,26.67 IC1.25
DIRC
  Top 0.254: IC2.13 56.52,30.64 67.31,19.84 IC1.22
DIRD  (via drill 0.3)
  Top 0.254: v56.52,38.89 IC2.16 | v61.91,32.38 v57.94,36.35
  Bottom 0.254: v56.52,38.89 56.52,37.78 v57.94,36.35 | v61.91,32.38 62.55,32.38 65.72,29.21 65.72,26.51 71.28,20.95 75.41,20.95 76.2,20.16 76.2,17.94 76.99,17.14 78.11,17.14 IC1.17
GND  (via drill 0.3)
  Top 0.508: D29.A IC6.13 IC6.12 | D29.A D30.A | IC8.6 IC8.7 IC8.8 64.93,71.28 69.69,71.28 73.5,67.47 76.04,67.47 D29.A | SEL.3 30.16,82.87 | 30.16,82.87 33.02,80.01 C10.2 34.45,80.17 38.26,80.17 IC9.14 45.24,87.15 48.74,87.15 IC9.11 49.85,84.14 v49.85,80.8 | D15.A IC4.13 IC4.12 27.78,61.12 28.1,61.12 28.57,60.64 28.57,59.69 28.1,59.21 26.19,59.21 IC4.5 IC4.4 D13.A D14.A | D15.A D16.A | D8.A D7.A IC3.13 IC3.12 24.29,40.48 24.29,36.99 v26.04,35.24 | 30.16,82.87 27.46,80.17 27.46,76.99 21.75,71.28 20.48,71.28 19.53,70.33 19.53,69.37 D15.A | SENS.5 60.96,5.08 C2.1 69.85,10.16 IC1.8 | C7.- 97.47,20.64 97.47,17.14 95.57,15.24 POWER.2 95.09,15.4 93.19,15.4 86.68,21.91 v83.98,21.91 | C3.1 85.09,5.08 C4.2 | D23.A IC5.13 IC5.12 | D23.A D24.A | IC7.6 IC7.7 IC7.8 | D27.A D28.A IC6.4 IC6.5 | D23.A 73.34,46.04 v73.34,49.53 | IC5.4 D21.A D22.A 80.8,28.42 80.8,25.4 78.74,23.34 C6.- | 63.02,35.4 63.34,35.08 74.14,35.08 IC5.4 | 63.02,35.4 61.12,37.31 61.12,38.26 62.23,39.37 C9.2 63.82,42.23 v63.82,45.56 | IC5.4 IC5.5 | R7.1 USB/DOA.1 34.13,5.24 33.81,5.24 32.07,6.99 32.07,11.43 | 32.07,11.43 29.21,11.43 DOA.6 26.51,14.13 26.51,16.35 DOA.4 DOA.3 22.54,18.1 22.54,19.84 25.56,22.86 RST.1 | 32.07,11.43 C1.2 | USB.S2 10.16,11.91 12.86,14.61 12.86,16.51 USB.4 12.7,16.67 10.16,19.21 USB.S1 10.32,23.97 15.08,23.97 D6.A | D6.A IC3.4 IC3.5 | D6.A D5.A | C5.2 73.66,20.32 IC1.19 | IC2.12 55.24,33.66 v54.45,34.45 | v62.87,35.08 62.87,35.24 63.02,35.4
  Bottom 0.508: IC8.8 59.85,66.2 59.85,73.5 IC9.8 55.72,77.63 55.72,78.58 53.5,80.8 v49.85,80.8 | D7.A 19.53,45.24 19.53,52.55 D13.A | POWER.2 94.93,15.24 89.22,9.53 89.22,4.13 C4.2 | C2.1 68.74,5.08 69.37,4.45 79.38,4.45 C3.1 | IC7.8 59.53,52.07 63.98,47.62 | 63.98,47.62 66.04,47.62 69.06,50.64 72.23,50.64 | D28.A 72.23,50.64 | 72.23,50.64 v73.34,49.53 | 34.29,33.02 RST.1 | 34.29,33.02 C8.2 41.59,35.56 42.7,34.45 v54.45,34.45 54.61,34.29 61.75,34.29 61.91,34.13 | C5.2 73.03,22.86 69.37,26.51 67.47,26.51 66.52,27.46 66.52,29.53 61.91,34.13 | 26.19,35.08 IC3.5 | 26.19,35.08 32.23,35.08 34.29,33.02 | 61.91,34.13 v62.87,35.08 | v63.82,45.56 63.82,47.47 63.98,47.62 | v83.98,21.91 79.69,21.91 C6.- | v26.04,35.24 26.19,35.08
MOTEN  (via drill 0.3)
  Top 0.254: IC4.9 31.75,59.53 33.66,57.63 33.66,42.55 IC3.9 | IC5.9 83.66,37.94 83.66,37.78 83.03,37.15 77.31,37.15 75.09,39.37 | 75.09,39.37 74.93,39.53 74.93,42.07 72.39,44.61 72.39,53.34 IC6.1 | 75.09,39.37 v73.34,37.62
  Bottom 0.254: 17.86,36.91 19.05,38.1 29.21,38.1 IC3.9 31.75,40.48 46.67,40.48 48.9,38.26 53.34,38.26 55.56,40.48 60.64,40.48 68.1,33.02 IC5.1 | 17.86,36.91 IC3.1 | IC4.1 15.88,55.24 15.88,42.39 15.24,41.75 15.24,39.53 17.86,36.91 | IC5.1 77.31,24.29 77.31,22.38 78.74,20.95 85.57,20.95 86.36,20.16 86.36,17.78 IC1.12 | IC6.1 72.71,61.28 82.87,61.28 IC6.9 | v73.34,37.62 68.74,33.02 IC5.1
N$1
  Top 0.254: IC3.11 26.67,43.02 25.24,44.45 11.59,44.45 7.78,40.64 A1.3
N$2
  Top 0.254: IC3.14 15.24,36.83 A2.3
N$3
  Top 0.254: IC3.6 24.13,35.56 10.16,35.56 A3.3
N$4
  Top 0.254: IC3.3 17.14,34.92 13.34,34.92 A4.3
N$5
  Bottom 0.254: IC4.14 17.14,62.87 10.79,62.87 B2.3
N$6
  Bottom 0.254: IC4.11 26.67,67.15 25.24,68.58 8.89,68.58 B1.3
N$7
  Bottom 0.254: IC4.6 26.67,57.94 23.65,60.96 11.43,60.96 8.89,58.42 B4.3
N$8
  Top 0.254: IC4.3 13.97,62.23 B3.3
N$9
  Top 0.254: IC1.11 79.38,13.34 85.72,13.34 R9.2
  Bottom 0.254: SENS.4 58.42,5.08 58.42,5.24 59.53,6.35 61.75,6.35 64.93,9.53 75.56,9.53 IC1.11
N$10
  Bottom 0.254: IC5.14 73.66,43.02 75.09,44.45 82.71,44.45 86.04,47.78 98.42,47.78 99.06,47.15 99.06,38.1 X2.3
N$11
  Top 0.254: IC5.11 81.28,43.02 86.04,47.78 98.42,47.78 99.06,47.15 99.06,41.91 X1.3
N$12
  Top 0.254: IC1.5 59.69,8.89 R8.2 58.26,7.62 55.88,5.24 55.88,5.08 SENS.3
N$13
  Bottom 0.254: 49.53,9.53 49.53,6.51 52.07,3.97 SENS.2 | 49.53,9.53 R5.2 | IC1.4 57.78,9.53 49.53,9.53
N$14
  Bottom 0.254: IC6.14 73.66,67.15 75.09,68.58 82.71,68.58 86.04,71.91 95.89,71.91 96.52,71.28 96.52,67.31 Y2.3
N$15
  Top 0.254: IC5.6 81.28,31.27 84.45,28.1 84.45,27.46 85.25,26.67 88.74,26.67 89.22,27.15 95.89,27.15 97.79,29.05 X4.3
N$16
  Top 0.254: IC6.11 81.28,67.15 86.68,72.55 95.25,72.55 97.79,70.01 Y1.3
N$17
  Bottom 0.254: IC5.3 73.66,30.64 75.09,29.21 79.85,29.21 82.87,26.19 85.72,26.19 86.36,25.56 86.36,22.7 87,22.07 90.81,22.07 93.82,25.08 93.82,25.88 95.09,27.15 95.89,27.15 96.52,27.78 96.52,30.64 97.79,31.91 X3.3
N$18
  Top 0.254: IC6.3 73.66,54.77 75.09,53.34 82.71,53.34 86.04,50.01 98.42,50.01 99.06,50.64 99.06,60.96 Y3.3
N$19
  Bottom 0.254: IC6.6 85.09,53.34 87.47,53.34 88.9,51.91 88.9,50.64 89.53,50.01 95.89,50.01 96.52,50.64 96.52,57.15 Y4.3
N$20
  Bottom 0.254: M3.1 2.54,55.72 3.81,56.99 3.81,68.58 B1.2
N$21
  Top 0.254: M3.2 5.08,53.98 3.81,55.24 3.81,64.77 B2.2
N$22
  Top 0.254: IC1.2 52.7,9.53 48.9,9.53 R4.2
  Bottom 0.254: R4.2 46.99,6.35 SENS.1
N$23  (via drill 0.3)
  Top 0.254: R11.1 21.59,78.26 25.4,82.07 SEL.2 26.67,86.36 26.67,86.52 27.3,87.15 v43.81,87.15 | v58.26,85.09 58.26,72.55 IC8.9
  Bottom 0.254: IC7.9 58.42,62.39 57.15,63.66 57.15,71.12 IC8.9 | v43.81,87.15 56.2,87.15 v58.26,85.09
N$24
  Top 0.254: B4.2 5.08,56.83 4.45,56.2 4.45,55.56 5.87,54.13 8.26,54.13 10.16,52.23 M3.4
N$25
  Bottom 0.254: B3.2 5.08,61.12 6.35,59.85 6.35,53.34 M3.3
N$26
  Top 0.254: R10.1 21.59,83.82 SEL.1
  Bottom 0.254: IC7.10 55.88,62.39 54.69,63.58 | 54.69,63.58 54.61,63.66 54.61,70.33 55.88,71.6 IC8.10 | R10.1 24.92,80.01 35.88,69.06 40.96,69.06 43.34,66.67 43.66,66.67 44.45,65.88 44.45,63.66 45.24,62.87 53.98,62.87 54.69,63.58
N$27
  Top 0.254: IC9.3 43.18,74.77 44.45,73.5 44.45,54.13 45.72,52.86 IC7.3
N$28
  Top 0.254: IC7.13 48.26,62.39 46.99,63.66 46.99,76.2 IC9.5
N$29
  Bottom 0.254: IC8.3 52.07,71.12 52.07,76.2 IC9.7
N$30
  Top 0.254: IC8.13 52.07,76.2 52.07,81.28 IC9.9
N$31
  Bottom 0.254: IC9.4 45.72,77.95 50.96,83.19 57.78,83.19 R12.1 59.69,84.93 60.8,83.82 67.79,83.82 69.06,85.09 LED.1
N$32
  Bottom 0.254: IC9.2 40.64,82.71 41.91,83.98 41.91,87.31 42.7,88.11 59.21,88.11 R13.1 62.23,85.25 64.14,87.15 75.56,87.15 76.2,86.52 76.2,86.36 LED.2
N$33
  Top 0.254: IC9.10 55.24,87 62.87,87 R14.1 64.77,85.25 66.67,87.15 78.11,87.15 78.74,86.52 78.74,86.36 LED.3
N$34
  Top 0.254: IC9.6 50.8,82.71 52.07,83.98 52.07,86.2 53.98,88.11 79.69,88.11 82.55,85.25 LED.4 82.55,84.93 80.64,83.03 74.3,83.03 72.23,85.09 R15.1
N$35
  Bottom 0.254: A4.2 6.35,27.94 6.35,27.78 6.99,27.15 8.26,27.15 10.16,29.05 M1.4
N$36
  Top 0.254: R12.2 60.48,77.47 61.75,78.74 71.12,78.74 1.K
N$37
  Bottom 0.254: R13.2 63.02,77.47 64.61,79.06 75.88,79.06 2.K
N$38
  Top 0.254: R14.2 65.56,77.47 69.69,73.34 78.42,73.34 3.K
N$39
  Bottom 0.254: R15.2 67.79,77.47 71.91,73.34 83.5,73.34 4.K
N$40
  Bottom 0.254: A3.2 5.08,34.13 6.35,35.4 6.35,44.45 M1.3
N$41
  Top 0.254: M1.1 2.54,43.34 5.08,40.8 A1.2
N$42
  Top 0.254: A2.2 5.08,37.94 6.35,39.21 6.35,44.45 M1.2
N$43
  Top 0.254: X1.2 93.98,41.91 93.98,42.07 92.39,43.66 92.08,43.66 90.17,45.56 M4.1
N$44
  Bottom 0.254: M4.2 92.71,43.34 93.98,42.07 93.98,38.1 X2.2
N$45
  Bottom 0.254: X4.2 95.25,30.32 96.52,31.59 96.52,44.45 M4.4
N$46
  Top 0.254: X3.2 95.25,34.13 96.52,35.4 96.52,44.45 M4.3
N$47
  Top 0.254: M2.1 90.17,70.01 92.08,71.91 93.34,71.91 95.25,70.01 Y1.2
N$48
  Top 0.254: M2.2 92.71,55.72 93.98,56.99 93.98,64.77 Y2.2
N$49
  Top 0.254: Y4.2 95.25,54.77 97.79,52.23 M2.4
N$50
  Bottom 0.254: M2.3 95.25,55.72 93.98,56.99 93.98,60.96 Y3.2
N$51
  Top 0.254: IC1.14 85.09,10.16 C4.1
N$54
  Bottom 0.254: IC1.16 79.38,15.88 31.91,15.88 27.15,20.64 14.61,20.64 13.02,19.05 USB.3
N$61  (via drill 0.3)
  Top 0.254: IC1.15 81.92,15.88 37.15,15.88 v36.2,16.83
  Bottom 0.254: v36.2,16.83 35.88,16.51 32.23,16.51 27.46,21.27 13.34,21.27 11.59,19.53 11.59,18.41 12.22,17.78 13.65,17.78 14.76,18.89 USB.2
N$62
  Bottom 0.254: R6.1 36.99,7.62 35.72,6.35 24.61,6.35 14.92,16.03 14.92,16.51 USB.1
N$63
  Top 0.254: R6.2 R7.2 45.72,4.92 48.9,1.75 72.55,1.75 77.15,6.35 80.49,6.35 82.55,8.41 IC1.13
N$64
  Top 0.254: RST.2 27.46,20.32 27.15,20.64 25.72,20.64 DOA.1
N$65
  Top 0.254: IC1.10 74.93,7.62 | 74.93,7.62 Q1.1 | 74.93,7.62 C3.2
N$66
  Top 0.254: IC1.9 72.39,8.89 Q1.2
  Bottom 0.254: Q1.2 66.04,6.35 C2.2
N$67
  Top 0.254: RST.3 C1.1 41.91,13.97 R3.1 45.24,11.43 46.51,12.7 50.8,12.7 IC1.1
N$71
  Top 0.508: DOA+5.1 22.86,7.62 DOA.9 DOA.7 | DOA.7 DOA.8 | DOA.7 DOA.5
N$72
  Top 0.254: IC1.23 62.55,16.83 37.94,16.83 35.72,19.05 DOA.2
N$73
  Top 0.254: DIAG.K R2.1
N$74
  Bottom 0.254: R2.2 41.91,11.91 44.93,14.92 61.28,14.92 IC1.6
N$75  (via drill 0.3)
  Top 0.254: IC1.7 65.41,13.34 v44.61,13.34
  Bottom 0.254: v44.61,13.34 43.18,11.91 43.18,10.95 41.12,8.89 DOA.10
N$76
  Top 0.254: USB/DOA.2 38.1,11.43 R1.1 41.91,8.89 54.61,8.89 IC1.3
OUT1A  (via drill 0.3)
  Top 0.254: IC2.7 48.9,34.77 v46.51,37.15 | v32.07,38.58 31.27,38.58 IC3.10 | D8.C D4.A 29.05,48.42 2.54,48.42 1.27,47.15 1.27,43.66 2.54,42.39 A1.1 | v41.12,57.15 41.12,54.93 36.2,50.01 v36.2,49.05
  Bottom 0.254: v46.51,37.15 43.81,39.85 33.34,39.85 v32.07,38.58 | IC7.12 48.26,57.15 v41.12,57.15 | v36.2,49.05 35.08,49.05 D4.A | D8.C IC3.10
OUT1B  (via drill 0.3)
  Top 0.254: IC2.22 48.9,44.45 v47.31,46.04 | v47.31,50.32 47.31,50.64 46.99,50.96 46.99,58.42 IC7.14 | IC4.10 D16.C D12.A | B1.1 2.54,70.96 4.13,72.55 21.91,72.55 23.81,74.45 v23.81,74.77
  Bottom 0.254: v47.31,50.32 v47.31,46.04 | v23.81,74.77 24.13,74.77 24.77,74.14 27.46,74.14 D12.A | IC7.14 43.81,61.59 37.47,61.59 D16.C
OUT1C
  Top 0.254: D32.A D30.C IC6.10 78.74,59.69 63.02,59.69 57.31,53.98 52.86,53.98 52.07,53.18 52.07,49.05 48.82,45.8 | IC2.21 50.16,44.45 48.82,45.8 | 48.82,45.8 47.62,46.99 46.99,46.99 44.45,49.53 44.45,53.18 43.18,54.45 IC7.15
  Bottom 0.254: D32.A Y1.1
OUT1D  (via drill 0.3)
  Top 0.254: D24.C IC5.10 | D24.C D20.A | X1.1 88.74,40.64 86.36,43.02 D24.C | IC2.8 50.16,35.08 v49.85,35.4 | v40.16,37.78 35.24,42.7 35.24,50.01 40.16,54.93 v40.16,56.52 | v85.88,35.88 84.3,35.88 82.55,34.13 v82.55,31.27 | v82.07,28.26 82.07,23.5 78.74,20.16 78.74,17.94 77.95,17.14 71.91,17.14 71.12,17.94 71.12,20.16 58.74,32.54 58.74,33.81 v56.2,36.35
  Bottom 0.254: v40.16,37.78 43.34,37.78 45.72,35.4 v49.85,35.4 50.8,36.35 v56.2,36.35 | v40.16,56.52 40.48,56.52 40.8,56.2 49.85,56.2 IC7.11 | IC5.10 83.82,37.94 v85.88,35.88 | v82.55,31.27 82.55,28.73 v82.07,28.26
OUT2A  (via drill 0.3)
  Top 0.254: D7.C IC3.15 | v3.81,47.31 4.29,47.78 11.91,47.78 D3.A | IC2.6 47.62,34.77 v45.4,36.99 | v40.32,38.89 40.32,51.75 IC7.1
  Bottom 0.254: D3.A D7.C | A2.1 2.54,37.94 3.81,39.21 v3.81,47.31 | v45.4,36.99 45.09,36.99 43.18,38.89 v40.32,38.89 | IC3.15 18.41,38.73 27.15,38.73 27.94,39.53 27.94,41.75 30.64,44.45 38.73,44.45 42.23,47.94 42.23,50.48 IC7.1
OUT2B  (via drill 0.3)
  Top 0.254: IC2.23 47.62,42.7 48.58,41.75 v49.21,41.75 | IC4.15 D15.C D11.A 11.91,71.91 4.45,71.91 3.81,71.28 3.81,68.42 2.54,67.15 | IC7.5 50.8,53.18 v53.34,55.72 | v22.7,74.61 21.43,74.61 20,73.18 3.17,73.18 1.27,71.28 1.27,68.42 2.54,67.15 | 2.54,67.15 B2.1
  Bottom 0.254: v49.21,41.75 52.39,44.93 52.39,50.48 IC7.5 | v53.34,55.72 50.32,55.72 50.16,55.56 38.58,55.56 30.48,63.66 30.48,66.2 26.67,70.01 26.67,72.55 25.72,73.5 23.81,73.5 v22.7,74.61
OUT2C  (via drill 0.3)
  Top 0.254: v51.44,45.4 IC2.20 | v45.4,49.85 47.62,47.62 v49.21,47.62 49.21,50.64 49.53,50.96 49.53,53.18 54.13,57.78 58.9,57.78 68.58,67.47 | IC6.15 D29.C 68.58,67.47 | 68.58,67.47 D31.A
  Bottom 0.254: v49.21,47.62 v51.44,45.4 | IC7.2 v45.4,49.85 | Y2.1 90.01,66.04 87.47,68.58 85.25,68.58 82.55,65.88 82.55,63.66 81.76,62.87 73.03,62.87 IC6.15
OUT2D  (via drill 0.3)
  Top 0.254: D19.A D23.C | v49.21,39.37 51.44,37.15 IC2.9 51.44,31.75 53.98,29.21 56.99,29.21 66.04,20.16 66.04,17.94 67.47,16.51 79.85,16.51 81.28,17.94 81.28,20.16 83.03,21.91 83.03,28.57 80.01,31.59 80.01,34.13 80.8,34.92 81.76,34.92 83.66,36.83 X2.1
  Bottom 0.254: IC5.15 D23.C 68.58,43.02 63.82,43.02 62.71,41.91 52.07,41.91 49.69,39.53 49.21,39.53 v49.21,39.37 48.26,40.32 IC7.4
OUT3A  (via drill 0.3)
  Top 0.254: IC3.7 D5.C D1.A | v45.09,30.8 IC2.4 | v42.23,70.33 42.23,69.69 v40.64,68.1 | v30.48,68.58 27.94,66.04 27.94,62.39 30.48,59.85 30.48,56.04 23.5,49.05 2.22,49.05 0.64,47.47 0.64,34.92 A3.1
  Bottom 0.254: v45.09,30.8 35.88,21.59 32.86,21.59 31.75,22.7 31.75,25.72 | D1.A 31.75,25.72 | IC8.12 48.74,70.33 v42.23,70.33 | v40.64,68.1 33.34,68.1 32.86,68.58 v30.48,68.58 | 31.75,25.72 11.43,25.72 10.64,26.51 5.08,26.51 3.81,27.78 3.81,31.75 A3.1
OUT3B  (via drill 0.3)
  Top 0.254: 13.97,54.13 D9.A | IC2.25 45.09,44.45 v41.27,48.26 | IC4.2 D13.C 13.97,54.13 | v26.51,79.69 25.56,79.69 19.68,73.82 2.86,73.82 0.64,71.6 0.64,64.14 B3.1 | v10.95,54.13 13.97,54.13
  Bottom 0.254: v41.27,48.26 38.26,48.26 33.18,53.34 28.1,53.34 25.4,56.04 25.4,58.26 24.61,59.05 18.41,59.05 IC4.2 | IC8.14 42.55,75.56 40.16,75.56 39.37,76.36 39.37,78.58 38.58,79.38 35.4,79.38 34.77,78.74 27.46,78.74 v26.51,79.69 | v10.95,54.13 9.53,54.13 8.89,53.5 8.89,50.64 8.26,50.01 1.91,50.01 1.27,50.64 1.27,60.96 B3.1
OUT3C  (via drill 0.3)
  Top 0.254: IC2.18 53.98,44.45 59.05,49.53 66.04,49.53 D25.A | IC8.15 43.18,67.31 v41.91,66.04
  Bottom 0.254: D25.A D28.C | D28.C IC6.2 73.03,59.05 81.6,59.05 84.77,62.23 Y3.1 | v41.91,66.04 41.91,63.66 43.34,62.23 53.18,62.23 54.61,60.8 54.61,58.58 57.63,55.56 64.14,55.56 65.09,54.61 D28.C
OUT3D  (via drill 0.3)
  Top 0.254: IC2.11 53.98,31.75 v55.56,30.16 | D21.C 68.26,30.16 v63.5,30.16 63.5,33.18 60.64,36.04 v60.64,36.35 | D21.C D17.A | D21.C IC5.2 | IC8.11 57.31,76.36 v57.31,77.47 | v97.16,48.74 86.04,48.74 80.64,43.34 80.64,42.39 80.01,41.75 80.01,39.53 81.44,38.1 v82.71,38.1 | v62.07,37.78 68.1,37.78 69.85,39.53 69.85,42.07 70.8,43.02 v70.8,48.1
  Bottom 0.254: v63.5,30.16 v55.56,30.16 | v57.31,77.47 57.94,77.47 62.87,72.55 97.79,72.55 99.06,71.28 99.06,50.64 v97.16,48.74 86.04,48.74 85.41,48.1 v70.8,48.1 | v82.71,38.1 82.71,37.78 85.57,34.92 90.81,34.92 X3.1 | v62.07,37.78 v60.64,36.35
OUT4A  (via drill 0.3)
  Top 0.254: IC2.5 46.35,33.5 v44.13,35.72 | IC3.2 D6.C D2.A 9.05,27.94 8.26,27.15 4.45,27.15 2.54,29.05 A4.1 | IC8.1 40.64,66.83 39.69,67.79 39.69,69.06 41.91,71.28 41.91,73.5 41.12,74.3 27.46,74.3 v25.08,71.91
  Bottom 0.254: v44.13,35.72 42.55,35.72 41.43,36.83 20.32,36.83 IC3.2 | v25.08,71.91 1.91,71.91 0.64,70.64 0.64,31.11 A4.1
OUT4B  (via drill 0.3)
  Top 0.254: IC2.24 46.35,44.45 v41.27,49.53 | D14.C D10.A | v49.05,79.38 40.16,79.38 39.37,78.58 39.37,76.36 38.26,75.25 v28.42,75.25 | B4.1 2.54,54.77 3.81,53.5 3.81,50.64 4.45,50.01 17.14,50.01 20.48,53.34 25.4,53.34 IC4.7
  Bottom 0.254: v41.27,49.53 37.94,49.53 32.86,54.61 D14.C IC4.7 26.67,59.69 26.67,60.48 27.94,61.75 27.94,66.83 26.04,68.74 26.04,72.23 25.4,72.87 23.18,72.87 21.75,74.3 21.75,74.93 22.54,75.72 24.13,75.72 24.61,75.25 v28.42,75.25 | IC8.5 50.8,67.47 54.61,71.28 54.61,78.58 53.82,79.38 v49.05,79.38
OUT4C  (via drill 0.3)
  Top 0.254: D26.A D27.C IC6.7 81.92,59.05 67.63,59.05 64.45,55.88 64.45,55.72 58.9,50.16 58.42,50.16 53.42,45.16 | IC2.19 52.7,44.45 53.42,45.16 | IC8.2 43.18,62.07 41.91,60.8 41.91,57.63 42.23,57.31 v42.23,53.82 | 53.42,45.16 v51.44,47.15
  Bottom 0.254: Y4.1 90.17,58.42 D27.C | v42.23,53.82 42.55,53.82 42.7,53.98 48.74,53.98 49.53,53.18 49.53,49.05 v51.44,47.15
OUT4D  (via drill 0.3)
  Top 0.254: 86.36,29.21 D22.C IC5.7 | 86.36,29.21 D18.A | 86.36,29.21 X4.1 | IC2.10 52.7,35.08 v53.02,35.4 | v80.8,36.04 72.39,36.04 | 72.39,36.04 v63.82,36.04 | IC8.4 51.44,61.59 v59.37,61.59 | v65.41,55.56 66.67,54.29 66.67,54.13 67.47,53.34 69.69,53.34 71.75,51.28 71.75,42.39 72.39,41.75 72.39,36.04
  Bottom 0.254: v53.02,35.4 61.91,35.4 62.55,36.04 v63.82,36.04 | IC5.7 v80.8,36.04 | v65.41,55.56 v59.37,61.59
RST
  Top 0.254: IC2.26 43.81,38.1 41.12,35.4 40.96,35.4 40.32,34.77 40.32,31.43 45.72,26.04 50.16,26.04 IC1.26
VM  (via drill 0.3)
  Top 0.508: MOTPWR.2 87.63,24.45 89.53,26.35 94.3,26.35 C7.+ | v82.55,62.23 82.55,60.96 IC6.8 | 18.1,60.64 18.57,60.17 v27.62,60.17 | 18.1,60.64 IC4.16 | v17.46,60.01 18.1,60.64 | IC6.16 66.99,64.77 57.15,54.93 v53.98,54.93 | IC5.16 64.77,44.45 64.77,48.26 v64.45,48.58
  Bottom 0.508: IC5.16 70.64,38.58 80.8,38.58 IC5.8 88.42,30.96 88.42,27.46 87.63,26.67 MOTPWR.2 | IC6.16 71.28,62.07 82.39,62.07 v82.55,62.23 | v27.62,60.17 28.73,60.17 IC4.8 34.13,54.77 53.82,54.77 v53.98,54.93 54.13,54.77 58.26,54.77 v64.45,48.58 | IC3.8 25.24,26.51 12.86,26.51 11.91,27.46 11.91,38.58 IC3.16 11.91,42.7 11.91,57.63 14.29,60.01 v17.46,60.01
VMOT
  Top 0.508: POWER.3 95.25,19.05 MOTPWR.3

### Text on the board
Top: henkie
Bottom: henkie
tNames: A | B | M | A | B | 0 | 0 | 0 | 1 | 1 | 0 | 2 | 0 | 1 | 3 | k | 1 | 1 | 4 | a | COIL / DRIVE | microSTEPPER / INTERFACE | + | V1.0 | +MT | GND | +5V